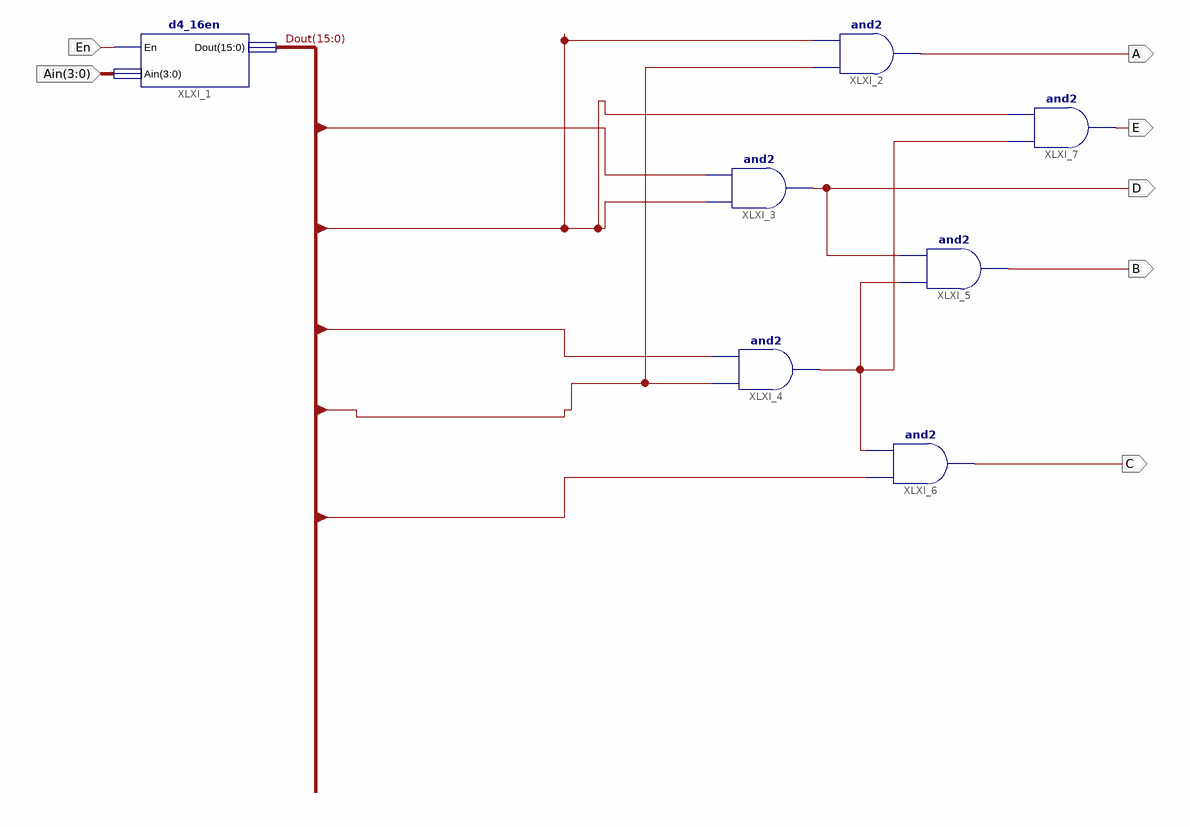
[diagram p0: schematic sheet 1]
// Xilinx ISE schematic lab6_experiment1_decimalDecoder.sch (spartan3e) as structural Verilog: 7 symbols, 7 ports
module lab6_experiment1_decimalDecoder (
  input  En,
  input  [3:0] Ain,
  output A,
  output D,
  output B,
  output C,
  output E
);

  wire XLXN_19;
  wire [15:0] Dout;

  d4_16en XLXI_1 (.En(En), .Ain(Ain), .Dout(Dout));
  and XLXI_2 (A, Dout[8], Dout[4]);
  and XLXI_4 (XLXN_19, Dout[8], Dout[6]);
  and XLXI_7 (E, XLXN_19, Dout[4]);
  and XLXI_3 (D, Dout[4], Dout[2]);
  and XLXI_6 (C, Dout[12], XLXN_19);
  and XLXI_5 (B, XLXN_19, D);
endmodule
